# EAGLE design Dumptruck2018 (EAGLE 7.6.0)
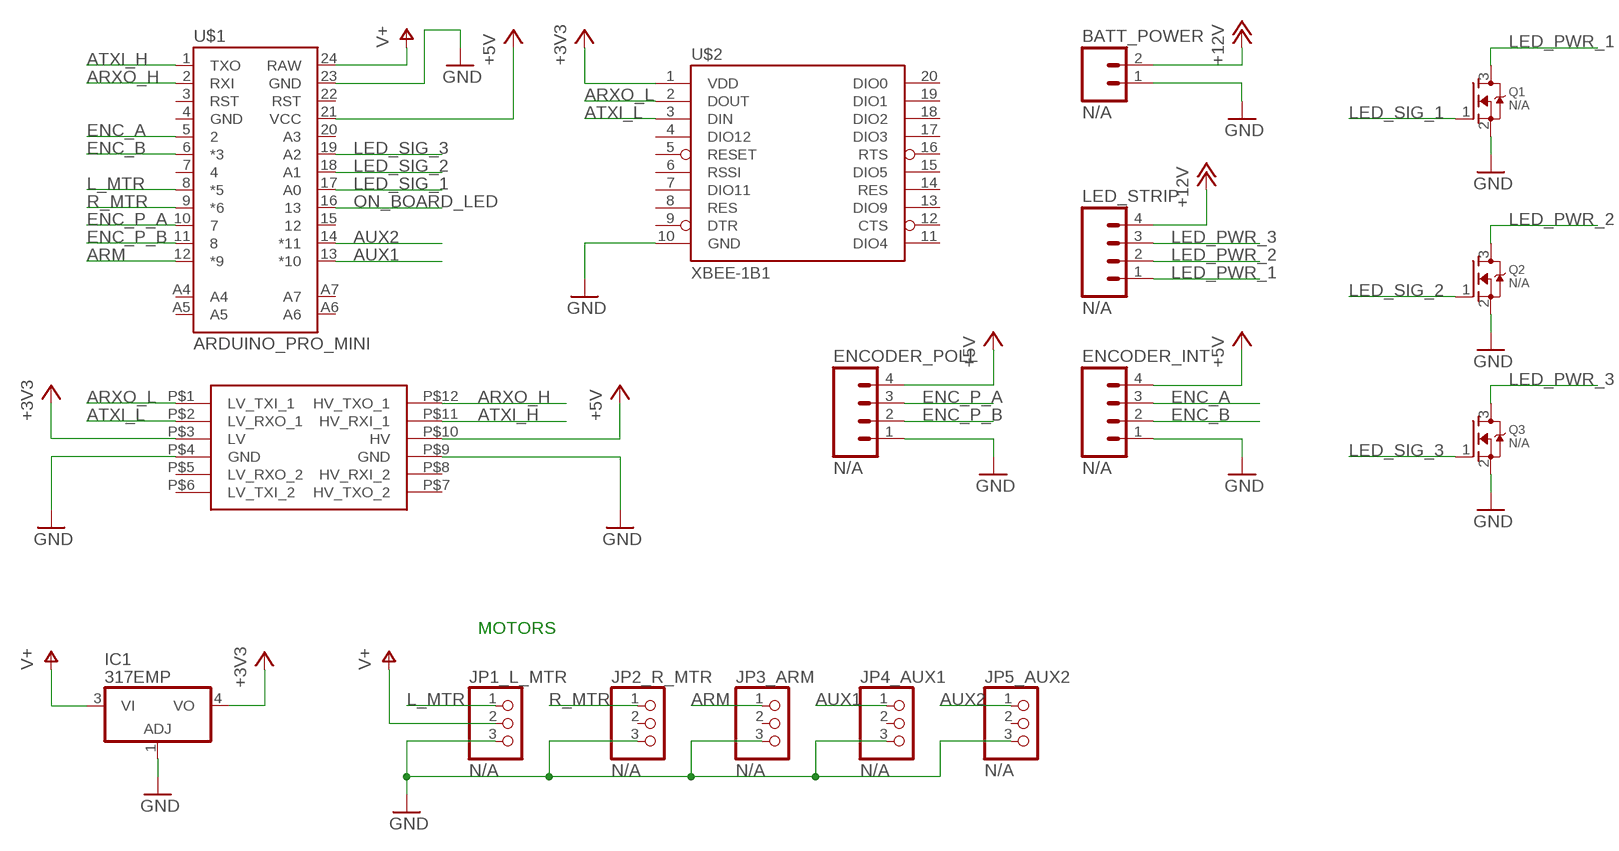
[diagram p0: schematic, sheet 1]

## Parts
BATT_POWER  N/A  M02PTH  [1X02]
ENCODER_INT  N/A  M04LOCK  [1X04_LOCK]
ENCODER_POLL  N/A  M04LOCK  [1X04_LOCK]
IC1  317EMP  [SOT223]
JP1_L_MTR  N/A  PINHD-1X3  [1X03]
JP2_R_MTR  N/A  PINHD-1X3  [1X03]
JP3_ARM  N/A  PINHD-1X3  [1X03]
JP4_AUX1  N/A  PINHD-1X3  [1X03]
JP5_AUX2  N/A  PINHD-1X3  [1X03]
LED_STRIP  N/A  M04LOCK  [1X04_LOCK]
Q1  N/A  MOSFET-NREFLOW  [SOT23]
Q2  N/A  MOSFET-NREFLOW  [SOT23]
Q3  N/A  MOSFET-NREFLOW  [SOT23]
U$1  ARDUINO_PRO_MINI  [ARDUINO_PRO_MINI]
U$2  XBEE-1B1  [XBEE-1]
U$3  LOGIC_LEVEL_CONVERTER  [LOGIC_LEVEL_CONVERTER]

## Nets
+3V3: IC1.4(VO) U$2.1(VDD) U$3.P$3(LV)
+5V: ENCODER_INT.4 ENCODER_POLL.4 U$1.21(VCC) U$3.P$10(HV)
+12V: BATT_POWER.2 LED_STRIP.4
ARM: JP3_ARM.1 U$1.12(*9)
ARXO_H: U$1.2(RXI) U$3.P$12(HV_TXO_1)
ARXO_L: U$2.2(DOUT) U$3.P$1(LV_TXI_1)
ATXI_H: U$1.1(TXO) U$3.P$11(HV_RXI_1)
ATXI_L: U$2.3(DIN) U$3.P$2(LV_RXO_1)
AUX1: JP4_AUX1.1 U$1.13(*10)
AUX2: JP5_AUX2.1 U$1.14(*11)
ENC_A: ENCODER_INT.3 U$1.5
ENC_B: ENCODER_INT.2 U$1.6(*3)
ENC_P_A: ENCODER_POLL.3 U$1.10
ENC_P_B: ENCODER_POLL.2 U$1.11
GND: BATT_POWER.1 ENCODER_INT.1 ENCODER_POLL.1 IC1.1(ADJ) JP1_L_MTR.3 JP2_R_MTR.3 JP3_ARM.3 JP4_AUX1.3 JP5_AUX2.3 Q1.2(S) Q2.2(S) Q3.2(S) U$1.23(GND) U$2.10(GND) U$3.P$4(GND) U$3.P$9(GND)
L_MTR: JP1_L_MTR.1 U$1.8(*5)
LED_PWR_1: LED_STRIP.1 Q1.3(D)
LED_PWR_2: LED_STRIP.2 Q2.3(D)
LED_PWR_3: LED_STRIP.3 Q3.3(D)
LED_SIG_1: Q1.1(G) U$1.17(A0)
LED_SIG_2: Q2.1(G) U$1.18(A1)
LED_SIG_3: Q3.1(G) U$1.19(A2)
ON_BOARD_LED: U$1.16
R_MTR: JP2_R_MTR.1 U$1.9(*6)
V+: IC1.3(VI) JP1_L_MTR.2 U$1.24(RAW)
Unconnected: JP2_R_MTR.2 JP3_ARM.2 JP4_AUX1.2 JP5_AUX2.2 U$1.3(RST) U$1.4(GND) U$1.7 U$1.15 U$1.20(A3) U$1.22(RST) U$1.A4 U$1.A5 U$1.A6 U$1.A7 U$2.4(DIO12) U$2.5(RESET) U$2.6(RSSI) U$2.7(DIO11) U$2.8(RES) U$2.9(DTR) U$2.11(DIO4) U$2.12(CTS) U$2.13(DIO9) U$2.14(RES) U$2.15(DIO5) U$2.16(RTS) U$2.17(DIO3) U$2.18(DIO2) U$2.19(DIO1) U$2.20(DIO0) U$3.P$5(LV_RXO_2) U$3.P$6(LV_TXI_2) U$3.P$7(HV_TXO_2) U$3.P$8(HV_RXI_2)

## Notes on the sheet
- MOTORS

## Library data of the parts
BATT_POWER = SparkFun-Connectors:M02: Standard 2-pin 0.1" header. Use with - straight break away headers ( PRT-00116) - right angle break away headers (PRT-00553) - swiss pins (PRT-00743) - machine pins (PRT-00117) - female headers (PRT-00115) Molex polarized connector foot print use with: PRT-08233 with associated crimp pins and housings. 2.54_SCREWTERM for use with PRT-10571. 3.5mm Screw Terminal footprints for PRT-08084 5mm Screw Terminal footprints for use with PRT-08432
ENCODER_INT ENCODER_POLL LED_STRIP = SparkFun-Connectors:M04: Header 4 Standard 4-pin 0.1" header. Use with straight break away headers (SKU : PRT-00116), right angle break away headers (PRT-00553), swiss pins (PRT-00743), machine pins (PRT-00117), and female headers (PRT-00115). Molex polarized connector foot print use with SKU : PRT-08231 with associated crimp pins and housings. 1MM SMD Version SKU: PRT-10208; PROD_ID: CONN-09696
IC1 = linear:*317: Positive VOLTAGE REGULATOR
JP1_L_MTR JP2_R_MTR JP3_ARM JP4_AUX1 JP5_AUX2 = adafruit:PINHD-1X3: PIN HEADER
Q1-Q3 = adafruit:MOSFET-N: N-Channel Mosfet 2N7002E - 60V 260mA SOT23 [Digikey: 2N7002ET1GOSTR-ND] - REEL BSH103 - 30V 850mA SOT23 [Digikey: 568-5013-1-ND]
U$1 = SparkFun-Boards:ARDUINO_PRO_MINI
U$2 = SparkFun-RF:XBEE-1: Xbee module footprints SMT header is CONN-09042.
U$3 = SparkFun-Boards:LOGIC_LEVEL_CONVERTER: Logic Level Converter (3.3v - 5v) https://www.sparkfun.com/products/8745

## Board
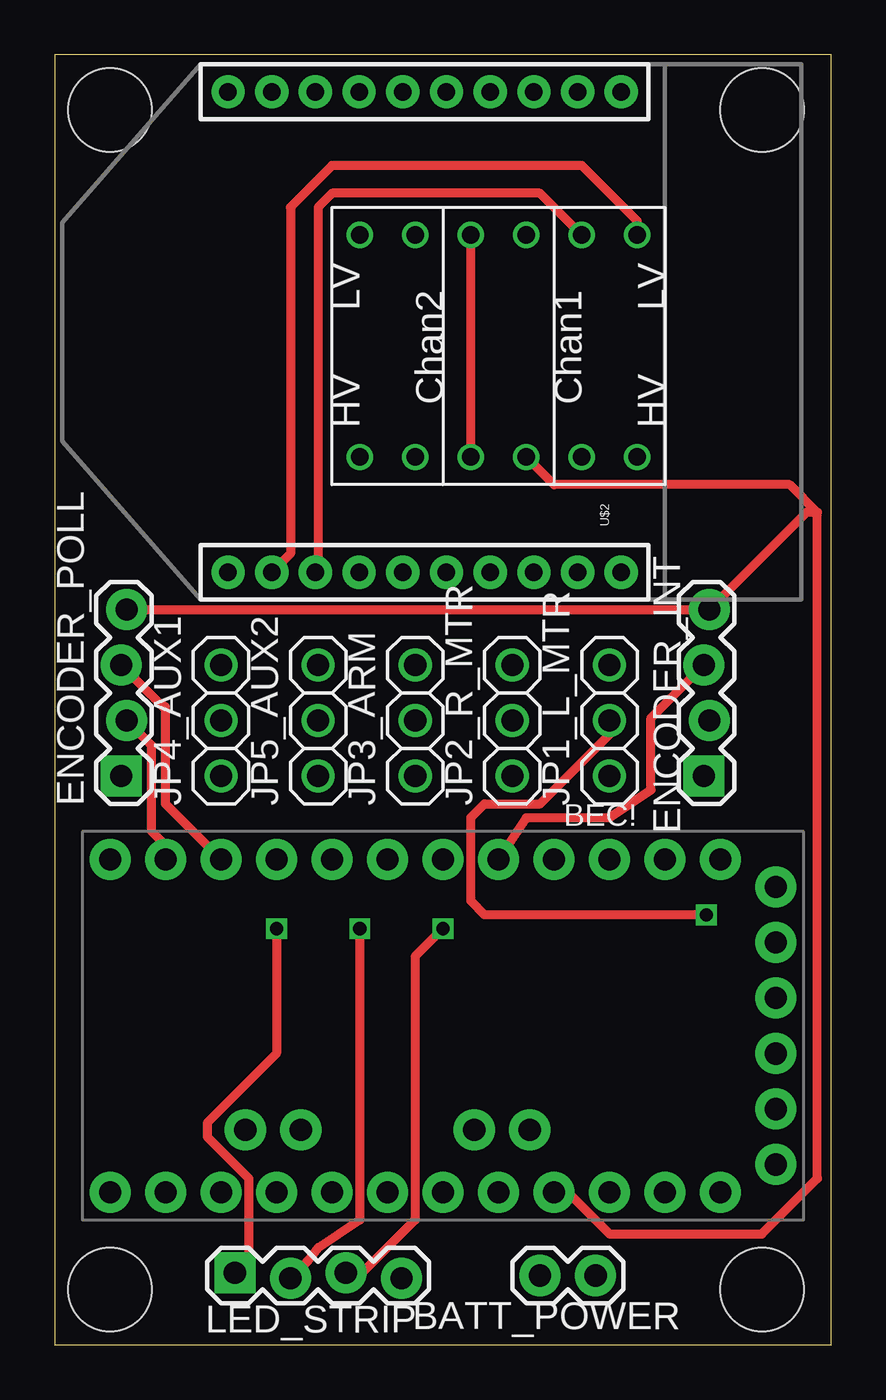
[diagram p1: board, top side]
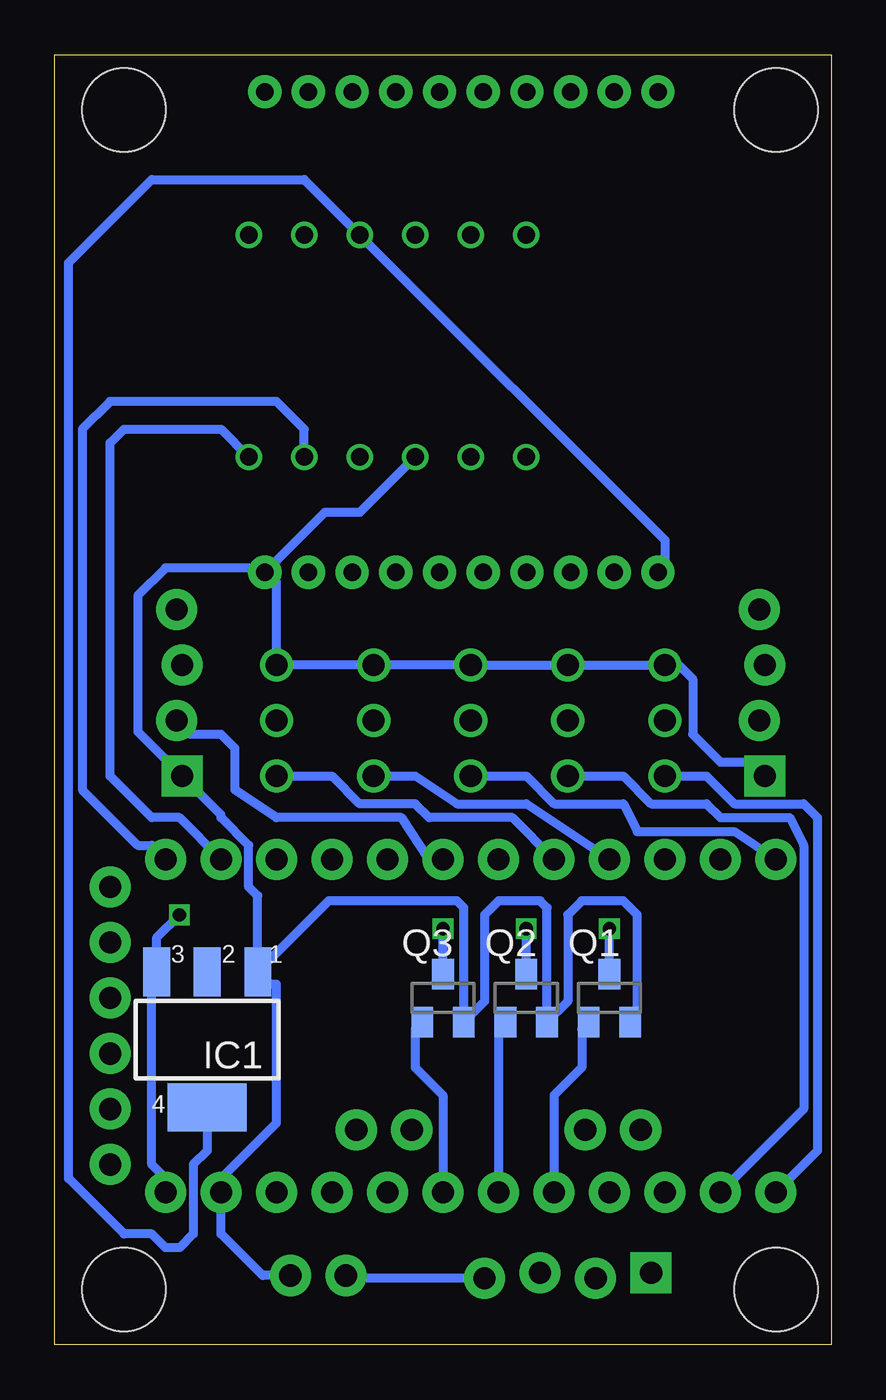
[diagram p2: board, bottom side, seen from below]

Size 35.56 x 59.05 mm. Coordinates in mm from the lower left corner, seen from the top.
Outline: 0,0 35.56,0 35.56,59.05 0,59.05 0,0
Copper layers (1*16): Top 0.0356mm / dielectric 1.5011mm / Bottom 0.0356mm
Design rules "LaenPCBOrder": minimum track width 6mil, minimum drill 13mil, track to track 6mil, track to pad 6mil, pad to pad 6mil, via to via 6mil, smd to smd 6mil, copper to edge 15mil, drill to drill 6mil, minimum pad ring 7mil, minimum via ring 7mil, stop-mask expansion 3mil, vias tented up to drill 0mil, thermal gap 10mil
Holes 3.81 mm at 2.54,56.52 32.38,56.52 2.54,2.54 32.38,2.54

### Footprints (pad centres in the part's own frame; a part is rotated, then mirrored left to right if it is on the bottom)
1X02 = drill 1.016 pad 1.88: 1 0,0; 2 2.54,0
1X04_LOCK = drill 1.016 pad 1.88 square: 1 0,0.127 | drill 1.016 pad 1.88: 2 2.54,-0.127; 3 5.08,0.127; 4 7.62,-0.127
SOT223 = smd 1.219 x 2.235: 1 -2.311,-3.099; 2 0,-3.099; 3 2.311,-3.099 | smd 3.6 x 2.2: 4 0,3.099
1X03 = drill 1.016: 1 -2.54,0; 2 0,0; 3 2.54,0
SOT23 = smd 1 x 1.4: 1 -0.95,-1.1; 2 0.95,-1.1; 3 0,1.1
ARDUINO_PRO_MINI = drill 1.016 pad 1.88: 1 -7.62,12.7; 2 -7.62,10.16; 3 -7.62,7.62; 4 -7.62,5.08; 5 -7.62,2.54; 6 -7.62,0; 7 -7.62,-2.54; 8 -7.62,-5.08; 9 -7.62,-7.62; 10 -7.62,-10.16; 11 -7.62,-12.7; 12 -7.62,-15.24; 13 7.62,-15.24; 14 7.62,-12.7; 15 7.62,-10.16; 16 7.62,-7.62; 17 7.62,-5.08; 18 7.62,-2.54; 19 7.62,0; 20 7.62,2.54; 21 7.62,5.08; 22 7.62,7.62; 23 7.62,10.16; 24 7.62,12.7; A4 4.763,1.429; A5 4.763,3.969; A6 4.763,-9.049; A7 4.763,-6.509; BLK -6.35,15.24; GND -3.81,15.24; GRN 6.35,15.24; RXI 1.27,15.24; TXO 3.81,15.24; VCC -1.27,15.24
XBEE-1 = drill 0.8 pad 1.524: 1 -11,20; 2 -11,18; 3 -11,16; 4 -11,14; 5 -11,12; 6 -11,10; 7 -11,8; 8 -11,6; 9 -11,4; 10 -11,2; 11 11,2; 12 11,4; 13 11,6; 14 11,8; 15 11,10; 16 11,12; 17 11,14; 18 11,16; 19 11,18; 20 11,20
LOGIC_LEVEL_CONVERTER = drill 0.8: P$1 1.27,13.97; P$2 1.27,11.43; P$3 1.27,8.89; P$4 1.27,6.35; P$5 1.27,3.81; P$6 1.27,1.27; P$7 11.43,1.27; P$8 11.43,3.81; P$9 11.43,6.35; P$10 11.43,8.89; P$11 11.43,11.43; P$12 11.43,13.97

### Placement (x,y rotation side)
BATT_POWER  24.77,3.17 180 top
ENCODER_INT  29.84,26.04 90 top
ENCODER_POLL  3.17,26.04 90 top
IC1  28.57,13.97 180 bottom
JP1_L_MTR  25.4,28.57 90 top
JP2_R_MTR  20.95,28.57 90 top
JP3_ARM  16.51,28.57 90 top
JP4_AUX1  7.62,28.57 90 top
JP5_AUX2  12.06,28.57 90 top
LED_STRIP  8.26,3.17 0 top
Q1  10.16,15.88 0 bottom
Q2  13.97,15.88 0 bottom
Q3  17.78,15.88 0 bottom
U$1  17.78,14.61 270 top
U$2  27.94,46.35 90 top
U$3  12.7,52.07 270 top

### Tracks (layer width: path | path; a pad name or v marks a point on that pad's centre or on a via)
+3V3
  Bottom 0.406: IC1.4 28.57,8.89 29.21,8.26 29.21,5.08 29.84,4.45 30.48,4.45 31.11,5.08 32.38,5.08 34.92,7.62 34.92,49.53 31.11,53.34 24.13,53.34 U$3.P$3 7.62,36.83 7.62,35.67 U$2.1
+5V
  Top 0.406: U$1.21 23.5,6.99 25.4,5.08 32.38,5.08 34.92,7.62 34.92,38.1 | 34.92,38.1 33.66,39.37 22.86,39.37 U$3.P$10 | 34.92,38.1 34.42,38.1 ENCODER_INT.4 ENCODER_POLL.4
+12V
  Bottom 0.406: LED_STRIP.4 22.1,3.05 BATT_POWER.2
ARM
  Bottom 0.406: JP3_ARM.1 13.97,26.04 12.7,24.77 9.53,24.77 8.89,23.5 4.45,23.5 U$1.12
ARXO_H
  Bottom 0.406: U$1.2 29.84,24.13 31.11,24.13 33.02,26.04 33.02,41.27 32.38,41.91 27.94,41.91 U$3.P$12
ARXO_L
  Top 0.406: U$3.P$1 26.67,51.44 24.13,53.98 12.7,53.98 10.79,52.07 10.79,36.21 U$2.2
ATXI_H
  Bottom 0.406: U$3.P$11 24.13,41.91 25.4,43.18 33.02,43.18 34.29,41.91 34.29,25.4 31.75,22.86 31.11,22.86 U$1.1
ATXI_L
  Top 0.406: U$3.P$2 22.23,52.7 12.7,52.7 12.06,52.07 12.06,35.48 U$2.3
AUX1
  Bottom 0.406: JP4_AUX1.1 5.71,26.04 4.45,24.77 1.27,24.77 0.64,24.13 0.64,8.89 U$1.13
AUX2
  Bottom 0.406: JP5_AUX2.1 9.53,26.04 8.26,24.77 5.71,24.77 5.08,24.13 1.91,24.13 1.27,22.86 1.27,10.79 U$1.14
ENC_A
  Top 0.406: U$1.5 21.59,24.13 25.4,24.13 27.3,25.4 27.3,28.7 ENCODER_INT.3
ENC_B
  Bottom 0.406: U$1.6 18.41,22.23 19.68,24.13 25.4,24.13 27.3,25.4 27.3,27.3 27.94,27.94 29.34,27.94 ENCODER_INT.2
ENC_P_A
  Top 0.406: U$1.10 5.08,24.77 5.08,29.21 4.95,29.21 ENCODER_POLL.3
ENC_P_B
  Top 0.406: U$1.11 5.08,22.86 4.45,23.5 4.45,27.43 ENCODER_POLL.2
GND
  Top 0.406: U$3.P$9 U$3.P$4
  Bottom 0.406: ENCODER_POLL.1 3.68,26.67 5.08,26.67 6.35,27.94 6.35,30.48 6.99,31.11 JP4_AUX1.3 JP5_AUX2.3 JP3_ARM.3 JP2_R_MTR.3 JP1_L_MTR.3 25.4,34.81 | Q1.2 9.21,14.92 8.89,15.24 8.89,19.68 9.53,20.32 11.43,20.32 12.06,19.68 12.06,15.73 Q2.2 13.02,20 13.34,20.32 15.24,20.32 15.88,19.68 15.88,15.73 Q3.2 16.83,20 17.14,20.32 23.01,20.32 IC1.1 | BATT_POWER.1 26.04,3.17 27.94,5.08 U$1.23 27.94,7.62 25.4,10.16 25.4,16.51 25.7,16.51 IC1.1 | IC1.1 26.26,20.55 26.67,20.95 26.67,22.86 27.94,24.13 27.94,24.26 ENCODER_INT.1 31.75,28.07 31.75,34.29 30.48,35.56 26.04,35.56 25.4,34.92 25.4,34.81 | 25.4,34.81 U$2.10 23.2,38.1 21.59,38.1 U$3.P$9
L_MTR
  Bottom 0.406: JP1_L_MTR.1 22.86,26.04 21.59,24.77 19.05,24.77 18.41,24.13 14.61,24.13 U$1.8
LED_PWR_1  (via drill 0.6)
  Top 0.406: v10.16,19.05 10.16,13.34 6.99,10.16 6.99,9.53 8.89,7.62 8.89,3.94 LED_STRIP.1
  Bottom 0.406: Q1.3 v10.16,19.05
LED_PWR_2  (via drill 0.6)
  Top 0.406: v13.97,19.05 13.97,5.71 12.06,4.45 11.56,3.81 LED_STRIP.2
  Bottom 0.406: Q2.3 v13.97,19.05
LED_PWR_3  (via drill 0.6)
  Top 0.406: v17.78,19.05 16.51,17.78 16.51,5.71 13.97,3.17 13.46,3.17 LED_STRIP.3
  Bottom 0.406: Q3.3 v17.78,19.05
LED_SIG_1
  Bottom 0.406: Q1.1 11.43,14.46 11.43,12.7 12.7,11.43 U$1.17
LED_SIG_2
  Bottom 0.406: Q2.1 15.24,14.46 U$1.18
LED_SIG_3
  Bottom 0.406: Q3.1 19.05,14.46 19.05,12.7 17.78,11.43 U$1.19
R_MTR
  Bottom 0.406: JP2_R_MTR.1 19.05,26.04 17.14,24.77 13.97,24.77 U$1.9
V+  (via drill 0.6)
  Top 0.406: v29.84,19.68 19.68,19.68 19.05,20.32 19.05,24.13 19.68,24.77 22.23,24.77 25.4,27.94 JP1_L_MTR.2
  Bottom 0.406: U$1.24 30.48,7.62 31.11,8.26 31.11,16.2 IC1.3 30.89,18.64 v29.84,19.68

### Text on the board
tNames: BEC!